# EasyEDA schematic LcsNodes-Building-Block-LCS-Bus-DCC-Signals.json
TITLE: LCS Bus - DCC Signal Input; REV: 1.0; Date: 2022-09-19; Sheet: 1/1; Drawn By: helmut-f; Company: Your Company
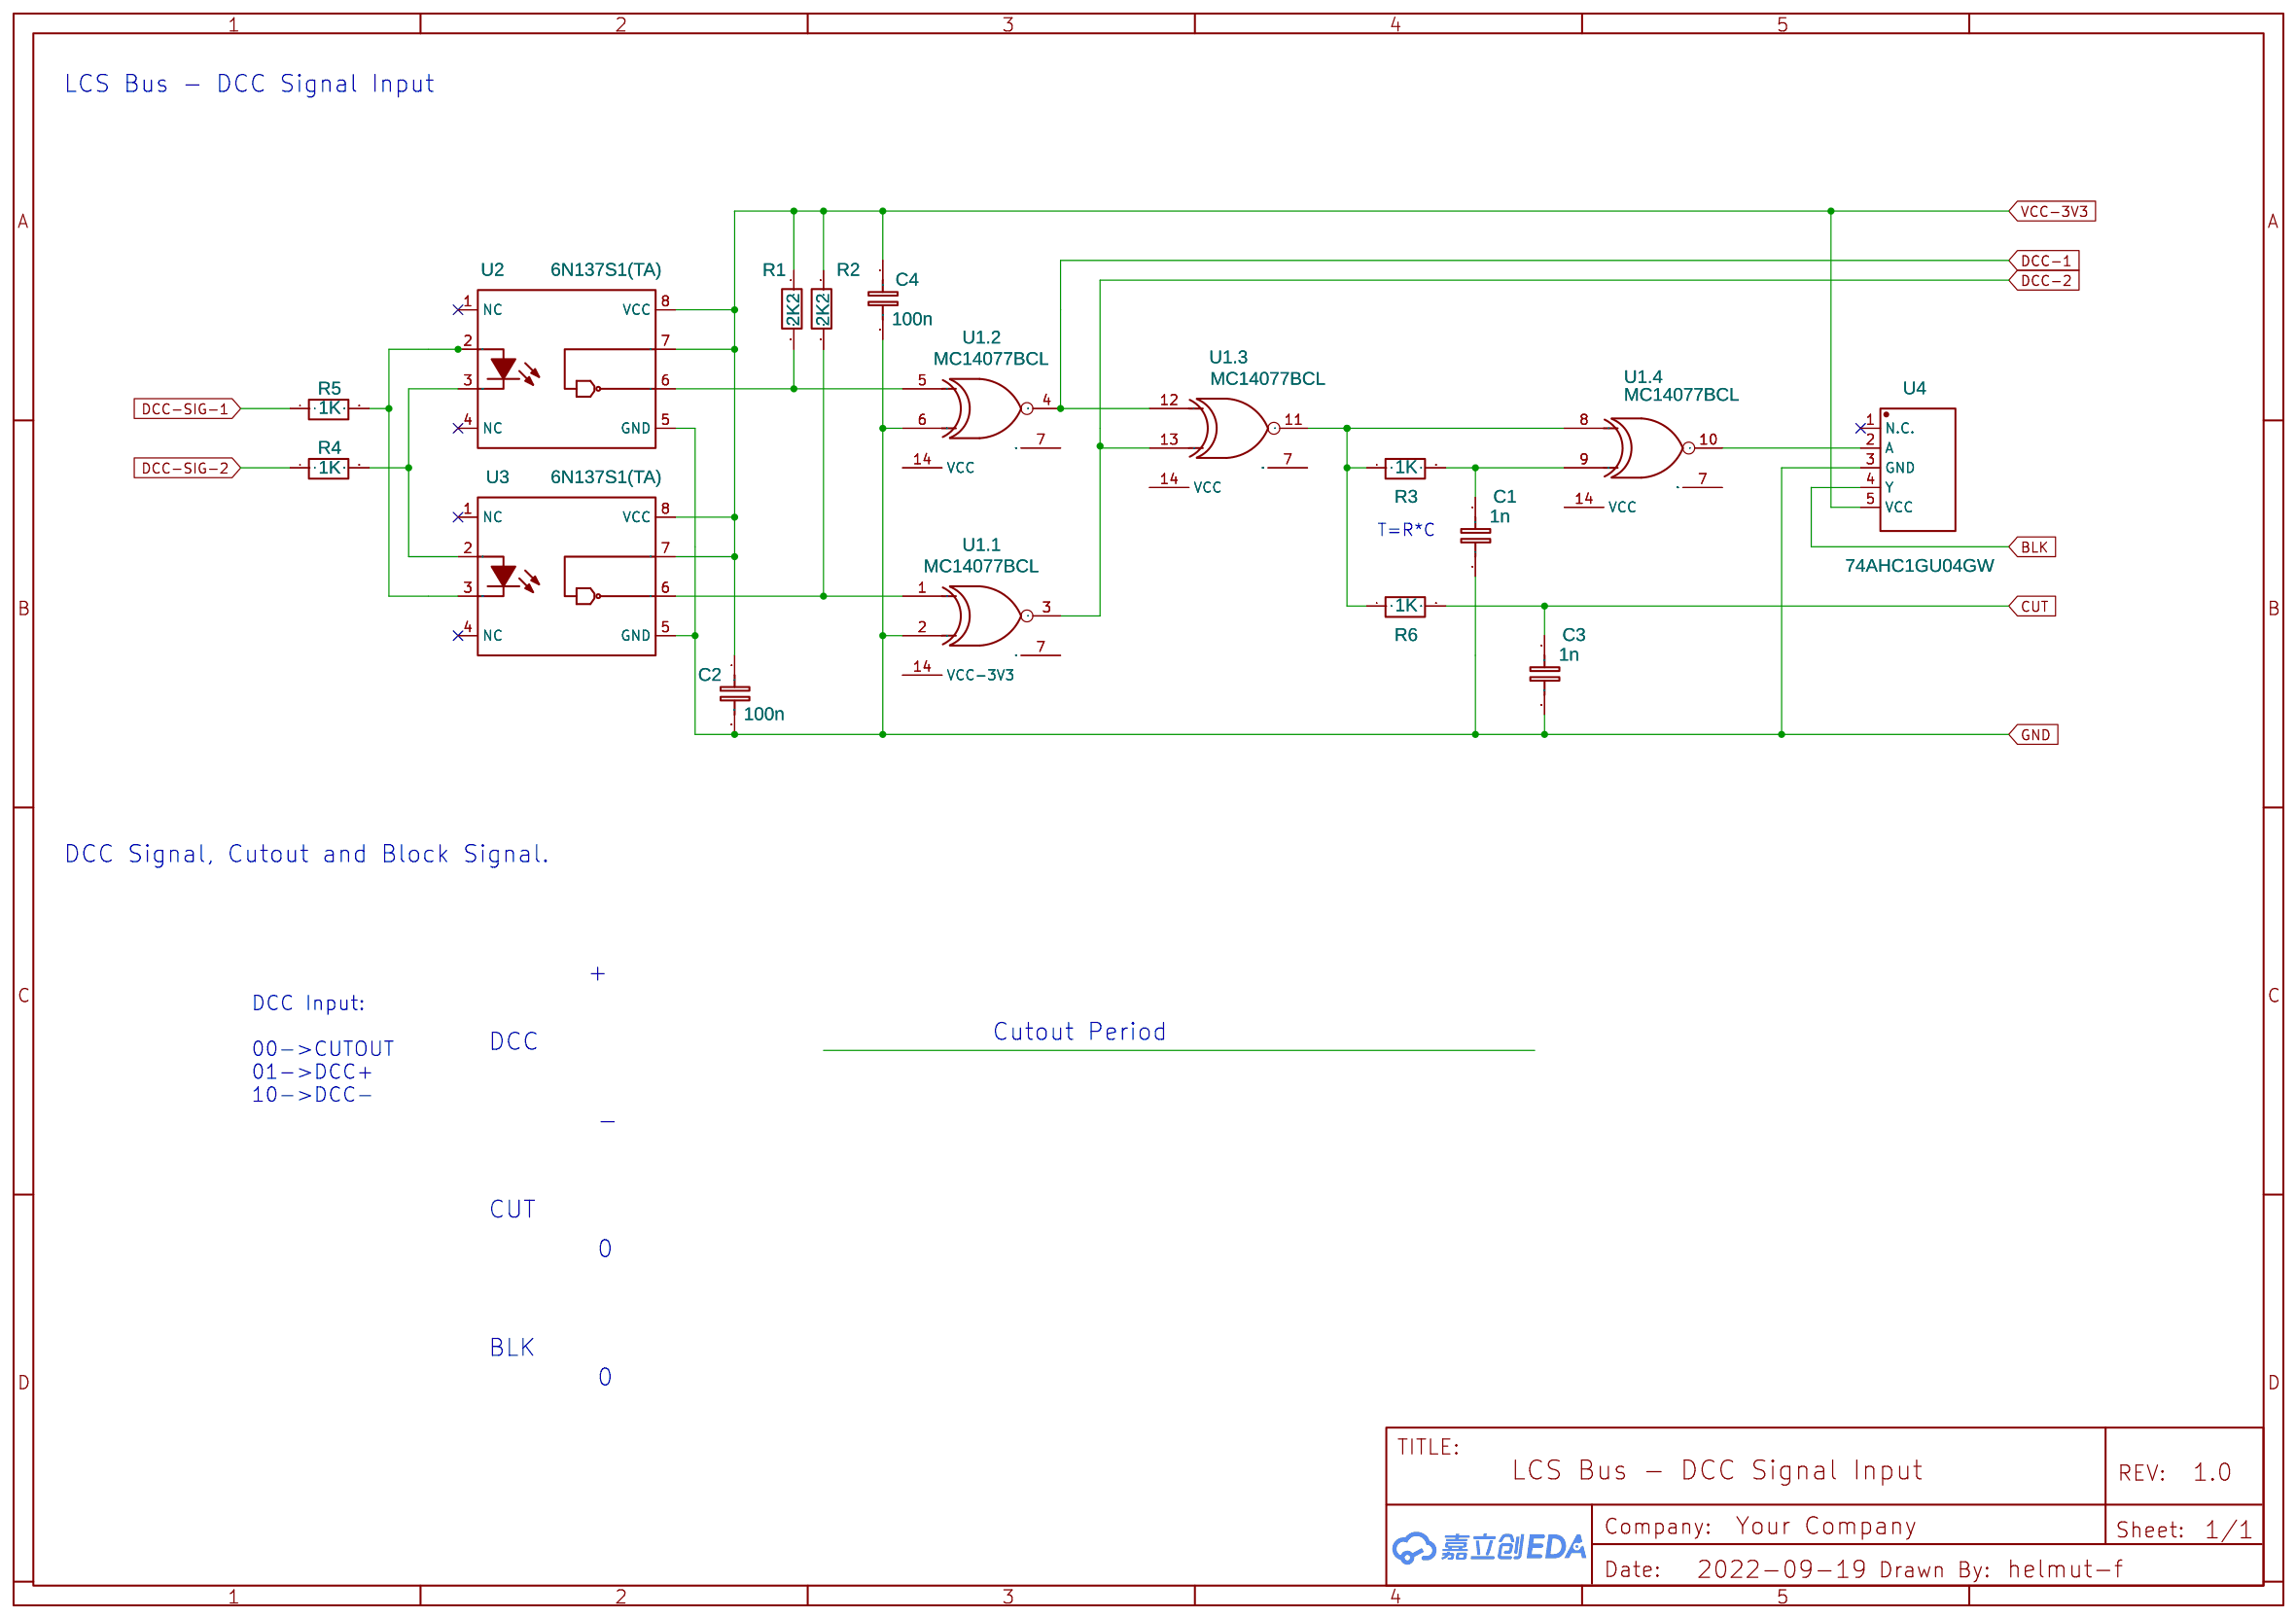
[diagram p0: schematic sheet]

## Parts
C1  1n  [1206]
C2  100n  [C1206]
C3  1n  [1206]
C4  100n  [C1206]
R1  2K2  [1206]
R2  2K2  [1206]
R3  1K  [1206]
R4  1K  [1206]
R5  1K  [1206]
R6  1K  [1206]
U1  MC14077BCL  [SO-14_L8.6-W3.9-P1.27-LS6.0-BL]  (sections 1,2,3,4)
U2  6N137S1(TA)  [SMD-8_L9.8-W6.6-P2.54-LS10.3-BL]
U3  6N137S1(TA)  [SMD-8_L9.8-W6.6-P2.54-LS10.3-BL]
U4  74AHC1GU04GW  [SOT-353_L2.2-W1.4-P0.65-LS2.4-BR]

## Library data of the parts
C1-C4 = C_0603_EU: Contributor: LCEDA_Lib; Package Display: No
R1 R3-R6 = R_AXIAL-0.3_EU: Contributor: LCEDA_Lib
R2 = R_AXIAL-0.3_EU: Contributor: LCEDA_Lib; Package Display: No
U1 = MC14077BCL: Quad XNOR Gate; subpart_no: 1; Package Display: No
U2 U3 = 6N137S1(TA): Supplier: LCSC; Supplier Part: C110020; Manufacturer: EVERLIGHT(亿光); Contributor: LCSC; JLCPCB Part Class: Basic Part
U4 = 74AHC1GU04GW: Supplier: LCSC; Manufacturer: Nexperia(安世); Manufacturer Part: 74AHC1GU04GW,125; Supplier Part: C5514; JLCPCB Part Class: Extended Part

## Nets
GND: C1.2 C2.2 C3.2 C4.2 U1.2(B) U1.6(B) U2.5(GND) U3.5(GND) U4.3(GND)
VCC-3V3: C2.1 C4.1 R1.1 R2.1 U2.7(VE) U2.8(VCC) U3.7(VE) U3.8(VCC) U4.5(VCC)
BLK: U4.4(Y)
CUT: C3.1 R6.2
DCC-1: U1.4(Y) U1.12(A)
DCC-2: U1.3(Y) U1.13(B)
DCC-SIG-1: R5.1
DCC-SIG-2: R4.1
Net-(C1-1): C1.1 R3.2 U1.9(B)
Net-(R1-2): R1.2 U1.5(A) U2.6(VOUT)
Net-(R2-2): R2.2 U1.1(A) U3.6(VOUT)
Net-(R3-1): R3.1 R6.1 U1.8(A) U1.11(Y)
Net-(R4-2): R4.2 U2.3(CAT) U3.2(AN)
Net-(R5-2): R5.2 U2.2(AN) U3.3(CAT)
Net-(U1.4-10): U1.10(Y) U4.2(A)

Not connected (* = marked no-connect by the designer): U1 7(GND) 14(VCC); U2 1(NC)* 4(NC)*; U3 1(NC)* 4(NC)*; U4 1(N.C.)*

## Notes on the sheet
- LCS Bus - DCC Signal Input
- T=R*C
- DCC Signal, Cutout and Block Signal.
- +
- DCC Input:
  00->CUTOUT
  01->DCC+
  10->DCC-
- Cutout Period
- DCC
- -
- CUT
- 0
- BLK
- 0
